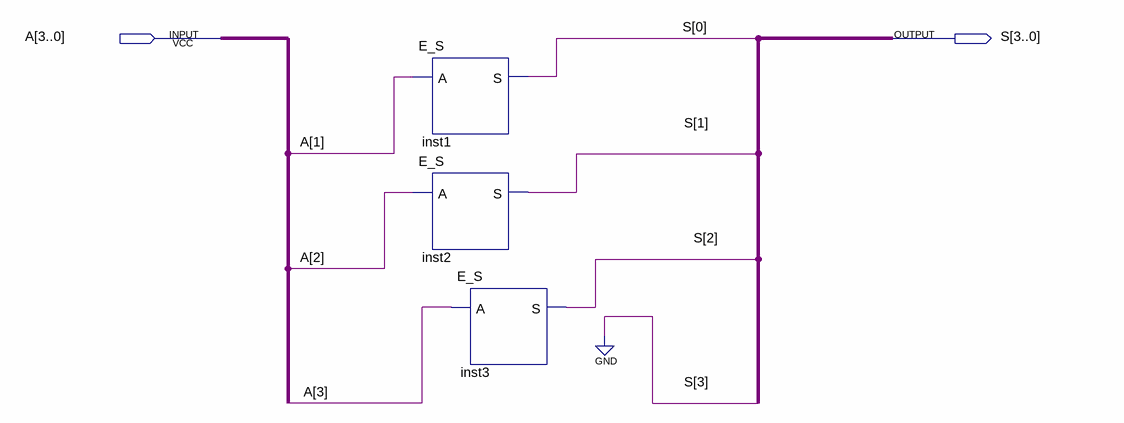
[diagram p0: schematic sheet]
// Quartus schematic Desloc_direita.bdf as structural Verilog: 3 symbols, 2 pins
module Desloc_direita (
  input  [3:0] A,
  output [3:0] S
);

  E_S inst1 (.A(A[1]), .S(S[0]));
  E_S inst2 (.A(A[2]), .S(S[1]));
  E_S inst3 (.A(A[3]), .S(S[2]));

  assign S[3] = 1'b0;
endmodule
